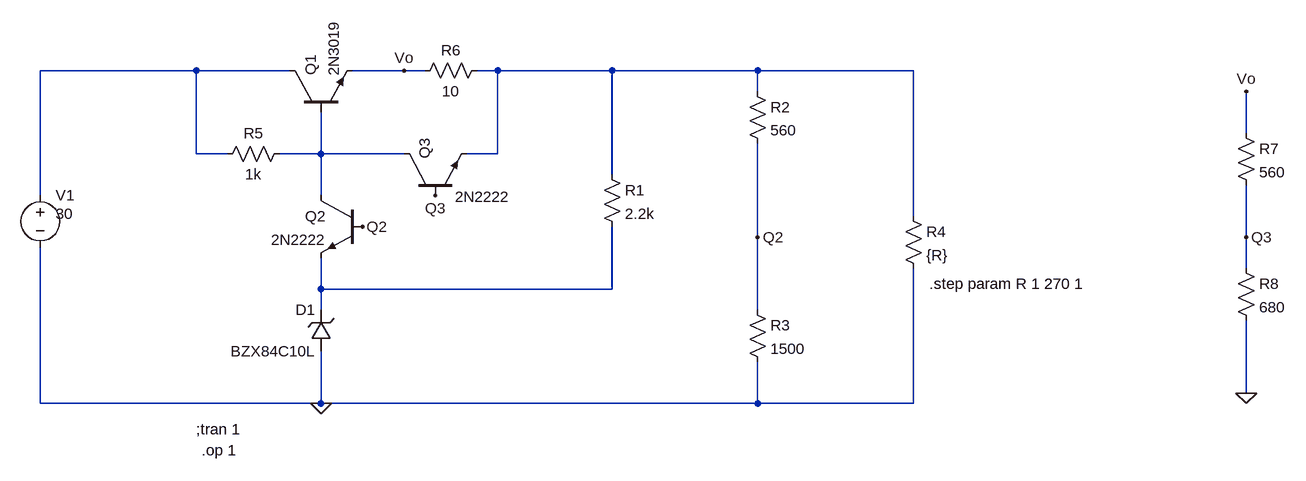
[diagram p0: schematic linear_rps_with_current_limiting.asc]
linear_rps_with_current_limiting.asc, the LTspice schematic file:
Version 4
SHEET 1 1796 680
WIRE 96 0 -144 0
WIRE 240 0 96 0
WIRE 416 0 336 0
WIRE 448 0 416 0
WIRE 560 0 528 0
WIRE 736 0 560 0
WIRE 960 0 736 0
WIRE 1200 0 960 0
WIRE 960 32 960 0
WIRE 1712 96 1712 32
WIRE 96 128 96 0
WIRE 144 128 96 128
WIRE 288 128 288 64
WIRE 288 128 224 128
WIRE 416 128 288 128
WIRE 560 128 560 0
WIRE 560 128 512 128
WIRE 736 160 736 0
WIRE -144 192 -144 0
WIRE 288 192 288 128
WIRE 1200 224 1200 0
WIRE 960 256 960 112
WIRE 1712 256 1712 176
WIRE 1712 304 1712 256
WIRE 288 336 288 288
WIRE 736 336 736 240
WIRE 736 336 288 336
WIRE 288 368 288 336
WIRE 960 368 960 256
WIRE 1712 496 1712 384
WIRE 1728 496 1712 496
WIRE -144 512 -144 272
WIRE 288 512 288 432
WIRE 288 512 -144 512
WIRE 960 512 960 448
WIRE 960 512 288 512
WIRE 1200 512 1200 304
WIRE 1200 512 960 512
FLAG 960 256 Q2
FLAG 288 512 0
FLAG 1712 496 0
FLAG 1712 32 Vo
FLAG 1712 256 Q3
FLAG 416 0 Vo
FLAG 464 192 Q3
FLAG 352 240 Q2
SYMBOL npn 352 192 M0
SYMATTR InstName Q2
SYMATTR Value 2N2222
SYMBOL npn 240 64 R270
SYMATTR InstName Q1
SYMATTR Value 2N3019
SYMBOL zener 304 432 R180
WINDOW 0 24 64 Left 2
WINDOW 3 24 0 Left 2
SYMATTR InstName D1
SYMATTR Value BZX84C10L
SYMBOL res 720 144 R0
SYMATTR InstName R1
SYMATTR Value 2.2k
SYMBOL res 944 16 R0
SYMATTR InstName R2
SYMATTR Value 560
SYMBOL res 944 352 R0
SYMATTR InstName R3
SYMATTR Value 1500
SYMBOL voltage -144 176 R0
WINDOW 123 0 0 Left 0
WINDOW 39 0 0 Left 0
WINDOW 3 24 44 Left 2
SYMATTR Value 30
SYMATTR InstName V1
SYMBOL res 240 112 R90
WINDOW 0 0 56 VBottom 2
WINDOW 3 32 56 VTop 2
SYMATTR InstName R5
SYMATTR Value 1k
SYMBOL res 432 16 R270
WINDOW 0 32 56 VTop 2
WINDOW 3 0 56 VBottom 2
SYMATTR InstName R6
SYMATTR Value 10
SYMBOL npn 416 192 R270
WINDOW 3 -2 78 VRight 2
SYMATTR Value 2N2222
SYMATTR InstName Q3
SYMBOL res 1696 80 R0
SYMATTR InstName R7
SYMATTR Value 560
SYMBOL res 1696 288 R0
SYMATTR InstName R8
SYMATTR Value 680
SYMBOL res 1184 208 R0
SYMATTR InstName R4
SYMATTR Value {R}
TEXT 96 552 Left 2 !;tran 1
TEXT 1224 328 Left 2 !.step param R 1 270 1
TEXT 104 584 Left 2 !.op 1

The netlist it stands for:
* linear_rps_with_current_limiting.asc
Q2 N003 Q2 N004 0 2N2222
Q1 N001 N003 Vo 0 2N3019
D1 0 N004 BZX84C10L
R1 N002 N004 2.2k
R2 N002 Q2 560
R3 Q2 0 1500
V1 N001 0 30
R5 N003 N001 1k
R6 Vo N002 10
Q3 N003 Q3 N002 0 2N2222
R7 Vo Q3 560
R8 Q3 0 680
R4 N002 0 {R}
.model D D
.lib standard.dio
.model NPN NPN
.model PNP PNP
.lib standard.bjt
;tran 1
.step param R 1 270 1
.op 1
.backanno
.end